# Altium schematic sheet 4_EVB-A32S1-M_Sensing.SchDoc
size A4; Author: Dennis C. M; CompanyName: Dennis Micro Computers; DrawnBy: Dennis C. M.; SheetNumber: 4; SheetTotal: 4; Size: A4
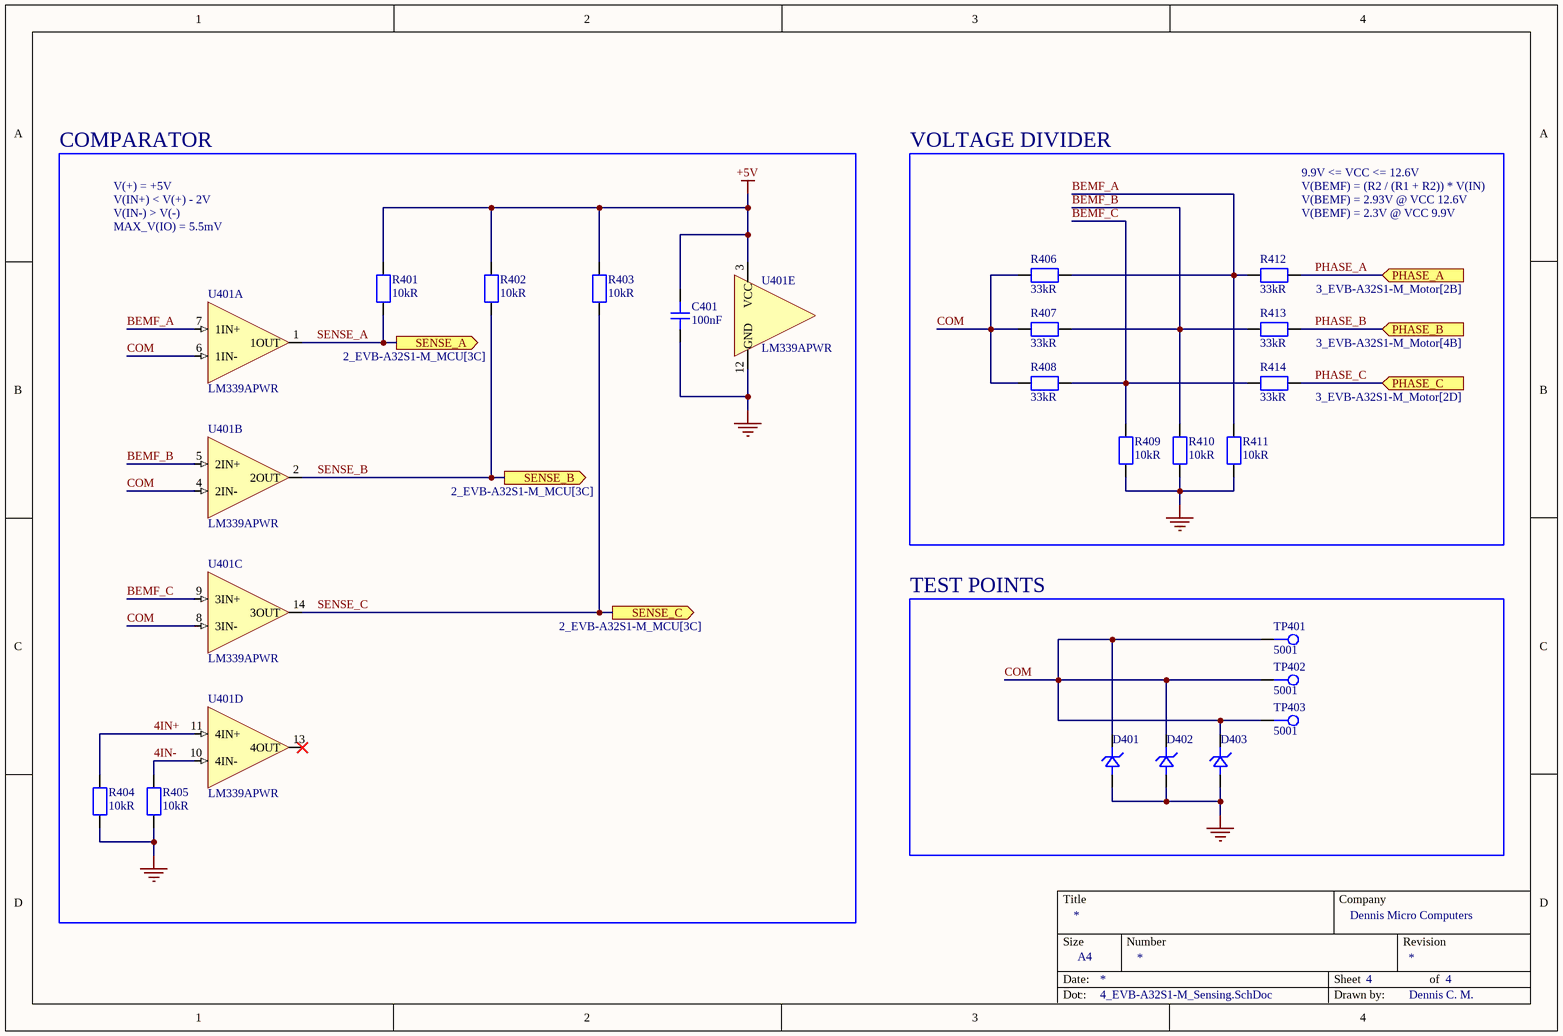
[diagram p0: 4_EVB-A32S1-M_Sensing.SchDoc]

## Parts
C401  value 100nF  [C_Samsung_CL_0402_A]  (hidden comment: CL05B104KP5NNNC)
D401  SMBJ15A-13-F  [D_TVS_Uni_Diodes_DO-214AA_B]  (value not drawn)
D402  SMBJ15A-13-F  [D_TVS_Uni_Diodes_DO-214AA_B]  (value not drawn)
D403  SMBJ15A-13-F  [D_TVS_Uni_Diodes_DO-214AA_B]  (value not drawn)
R401  value 10kR  [R_Yageo_RCL_0402_A]  (hidden comment: RC0402FR-0710KL)
R402  value 10kR  [R_Yageo_RCL_0402_A]  (hidden comment: RC0402FR-0710KL)
R403  value 10kR  [R_Yageo_RCL_0402_A]  (hidden comment: RC0402FR-0710KL)
R404  value 10kR  [R_Yageo_RCL_0402_A]  (hidden comment: RC0402FR-0710KL)
R405  value 10kR  [R_Yageo_RCL_0402_A]  (hidden comment: RC0402FR-0710KL)
R406  value 33kR  [R_Yageo_RCL_0402_A]  (hidden comment: RC0402FR-0733KL)
R407  value 33kR  [R_Yageo_RCL_0402_A]  (hidden comment: RC0402FR-0733KL)
R408  value 33kR  [R_Yageo_RCL_0402_A]  (hidden comment: RC0402FR-0733KL)
R409  value 10kR  [R_Yageo_RCL_0402_A]  (hidden comment: RC0402FR-0710KL)
R410  value 10kR  [R_Yageo_RCL_0402_A]  (hidden comment: RC0402FR-0710KL)
R411  value 10kR  [R_Yageo_RCL_0402_A]  (hidden comment: RC0402FR-0710KL)
R412  value 33kR  [R_Yageo_RCL_0402_A]  (hidden comment: RC0402FR-0733KL)
R413  value 33kR  [R_Yageo_RCL_0402_A]  (hidden comment: RC0402FR-0733KL)
R414  value 33kR  [R_Yageo_RCL_0402_A]  (hidden comment: RC0402FR-0733KL)
TP401  5001  [TP_Keystone_TH]
TP402  5001  [TP_Keystone_TH]
TP403  5001  [TP_Keystone_TH]
U401  LM339APWR  [U_TI_14-TSSOP-5.00x4.40mm_0.62mm_B]  (parts A,B,C,D,E of 5)

## Blocks framed on the sheet
COMPARATOR: C401 R401-R405 U401
VOLTAGE DIVIDER: R406-R414
TEST POINTS: D401-D403 TP401-TP403

## Ports
PHASE_A (in, see 3_EVB-A32S1-M_Motor[2B]), PHASE_B (in, see 3_EVB-A32S1-M_Motor[4B]), PHASE_C (in, see 3_EVB-A32S1-M_Motor[2D]), SENSE_A (out, see 2_EVB-A32S1-M_MCU[3C]), SENSE_B (out, see 2_EVB-A32S1-M_MCU[3C]), SENSE_C (out, see 2_EVB-A32S1-M_MCU[3C])

## Nets
+5V: C401.2 R401.2 R402.2 R403.2 U401.3(VCC)
GND: C401.1 D401.2 D402.2 D403.2 R404.1 R405.1 R409.1 R410.1 R411.1 U401.12(GND)
4IN+: R404.2 U401.11(4IN+)
4IN-: R405.2 U401.10(4IN-)
BEMF_A: R406.2 R411.2 R412.1 U401.7(1IN+)
BEMF_B: R407.2 R410.2 R413.1 U401.5(2IN+)
BEMF_C: R408.2 R409.2 R414.1 U401.9(3IN+)
COM: D401.1 D402.1 D403.1 R406.1 R407.1 R408.1 TP401.1 TP402.1 TP403.1 U401.4(2IN-) U401.6(1IN-) U401.8(3IN-)
PHASE_A: R412.2 ; port PHASE_A
PHASE_B: R413.2 ; port PHASE_B
PHASE_C: R414.2 ; port PHASE_C
SENSE_A: R401.1 U401.1(1OUT) ; port SENSE_A
SENSE_B: R402.1 U401.2(2OUT) ; port SENSE_B
SENSE_C: R403.1 U401.14(3OUT) ; port SENSE_C

Not connected (* = marked no-connect by the designer): U401 13(4OUT)*

## Notes on the sheet
- 9.9V <= VCC <= 12.6V
- V(IN+) < V(+) - 2V
- V(IN-) > V(-)
- MAX_V(IO) = 5.5mV
- V(+) = +5V
- V(BEMF) = (R2 / (R1 + R2)) * V(IN)
- V(BEMF) = 2.93V @ VCC 12.6V
- V(BEMF) = 2.3V @ VCC 9.9V
- Title
- Company
- Size
- Date:
- A4
- Number
- Sheet
- Revision
- of
- Doc:
- Drawn by:

## Library data of the parts
C401 = CMP-001-00023-3: Multilayer Ceramic Capacitor, 0.1 uF, 10 V, ± 10%, X7R, 0402 [1005 Metric]; Voltage Rating (DC): 10V; Case/Package: 0402; Material: Ceramic; Case Code (Metric): 1005; Series: CL; Dielectric: X7R; Mounting Technology: Surface Mount; Tolerance: 10%; Packaging: Tape and Reel; Min Operating Temperature: -55°C; Max Operating Temperature: 125°C; RoHS Compliant: Yes; Height: 0.5mm; Voltage Rating: 10V; Case Code (Imperial): 0402; Construction: Flat; Depth: 0.5mm; Length: 1mm; Package Quantity: 1; Radiation Hardening: No; Thickness: 0.022inch; Width: 0.02inch
D401-D403 = CMP-004-00005-3: TVS Diode Single Uni-Dir 15V 600W 2-Pin SMB T/R / TVS DIODE 15VWM 24.4VC SMB; Max Reverse Leakage Current: 5uA; Max Surge Current: 24A; Diode Type: ZENER; Power Line Protection: No; Direction: Unidirectional; Breakdown Voltage: 19.2V; Clamping Voltage: 24.4V; Value: 800pF; Min Breakdown Voltage: 16.7V; Number of Unidirectional Channels: 1; Forward Voltage: 5V; Test Current: 1mA; Working Voltage: 15V; Max Power Dissipation: 600W; Reverse Standoff Voltage: 15V; Case/Package: SMB; Max Operating Temperature: 150°C; Mounting Technology: Surface Mount; Peak Pulse Current: 24A; Packaging: Tape and Reel; RoHS Compliant: Yes; Package Quantity: 3000; Series: SMBJ; Termination: SMD/SMT; Polarity: Unidirectional; Peak Pulse Power: 600W; Min Operating Temperature: -55°C; Clamping Voltage-Max: 24.4V; Height: 2.62mm; Lead Free: Lead Free; Leakage Current: 5uA; Length: 4.57mm; Max Breakdown Voltage: 19.2V; Max Output current: 24A; Number of Elements: 1; Pins: 2; Power Dissipation: 600W; Radiation Hardening: No; Reverse Breakdown Voltage: 16.7V; Voltage Rating (DC): 15V; Width: 3.9mm
R401-R405 R409-R411 = CMP-009-00003-11: SMD Chip Resistor, 10 kOhm, ± 1%, 62.5 mW, 0402 [1005 Metric], Thick Film, General Purpose; Power Rating: 62.5mW; Temperature Coefficient: 100ppm/°C; Max Power Dissipation: 63mW; Voltage Rating (DC): 50V; Min Operating Temperature: -55°C; Case/Package: 0402; Depth: 0.5mm; Reach SVHC Compliant: Unknown; Case Code (Imperial): 0402; Series: RC; Case Code (Metric): 1005; Resistor Type: Thick Film; Pins: 2; Termination: SMD/SMT; Features: Moisture Resistant; ComponentLink1URL: https://www.yageo.com/upload/media/product/products/datasheet/rchip/PYu-RC_Group_51_RoHS_L_12.pdf; Max Operating Temperature: 155°C; RoHS Compliant: Yes; Number of Terminations: 2; Military Standard: Not; Lead Free: Lead Free; Construction: Rectangular; Tolerance: 1%; Length: 1mm; ComponentLink1Description: Datasheet; Resistance Tolerance: 1%; Packaging: Tape and Reel; Lead Pitch: 0.2mm; Voltage Rating: 50V; Width: 0.5mm
R406-R408 R412-R414 = CMP-009-00005-12: SMD Chip Resistor, 33 kOhm, ± 1%, 63 mW, 0402 [1005 Metric], Thick Film, General Purpose; Power Rating: 63mW; Temperature Coefficient: 100ppm/°C; Voltage Rating (AC): 50V; Tolerance: 1%; Military Standard: Not; Features: Moisture Resistant; RoHS Compliant: Yes; Construction: Rectangular; Number of Terminations: 2; Min Operating Temperature: -55°C; Case Code (Metric): 1005; Resistor Type: Thick Film; Max Power Dissipation: 63mW; Voltage Rating (DC): 50V; Pins: 2; Series: RC; Termination: SMD/SMT; ComponentLink1Description: Datasheet; Max Operating Temperature: 155°C; Case/Package: 0402; Reach SVHC Compliant: No; Case Code (Imperial): 0402; Height: 0.016inch; Depth: 0.5mm; Length: 1mm; Package Quantity: 1; Lead Free: Lead Free; Resistance Tolerance: 1%; Weight: 2.3E-05oz; Width: 0.5mm; Packaging: Tape and Reel; Voltage Rating: 50V; ComponentLink1URL: https://www.yageo.com/upload/media/product/products/datasheet/rchip/PYu-RC_Group_51_RoHS_L_12.pdf
TP401-TP403 = CMP-000000-5: TEST POINT, PCB, THROUGH HOLE; Product R; Range: -; Connector Colour: Black; Mounting: Through Hole; Body Material: Bronze; Insulation: Insulated; Plating: Silver; Number of Ports: 1; Inside Diameter: 1.27mm; Hole Diameter: 1.6mm; Outside Diameter: 2.54mm; Lead Free: Lead Free; Series: THM; Mounting Technology: Through Hole; Material: Nylon,Bronze,Silver; Color: Black; Packaging: Bulk; ComponentLink1URL: https://www.keyelco.com/userAssets/file/M65p56.pdf; Housing Color: Black; Reach SVHC Compliant: No; ComponentLink1Description: Datasheet; RoHS Compliant: Yes; Termination: Through Hole; Contact Plating: Tin,Silver; Diameter: 2.54mm; Insulation Material: Nylon; Contact Material: Bronze; Orientation: Straight; Number of Contacts: 1; Length: 7.62mm; Package Quantity: 100
U401 = CMP-016-00000-9: Precision quad differential comparator, commercial grade 14-TSSOP 0 to 70; Output Compatibility: CMOS; Supply Current: 2mA; Min Dual Supply Voltage: 1V; Max Dual Supply Voltage: 15V; Max Supply Current: 500uA; Voltage Gain: 106.02dB; Output Current per Channel: 6mA; Input Offset Voltage (Vos): 3mV; Max Input Current: 250nA; Min Supply Voltage: 2V; Number of Channels: 4; Max Supply Voltage: 30V; Output Type: TTL; Response Time: 1.3us; Output Current: 20mA; Quiescent Current: 2.5mA; Pins: 14; Case/Package: TSSOP; Series: -; Reach SVHC Compliant: No; Weight: 0.002018oz; Packaging: Tape and Reel; Radiation Hardening: No; Input Bias Current: 250nA; Package Quantity: 2000; Mounting Technology: Surface Mount; Technology: BIPOLAR; ComponentLink1URL: https://www.ti.com/lit/ds/symlink/lm339.pdf?HQS=dis-dk-null-digikeymode-dsf-pf-null-wwe&ts=1718677814239; Min Operating Temperature: 0°C; ComponentLink1Description: Datasheet; Max Operating Temperature: 70°C; RoHS Compliant: Yes; Number of Elements: 4; Lead Free: Lead Free